# EAGLE schematic UmnitsaRGB (EAGLE 9.3.0)
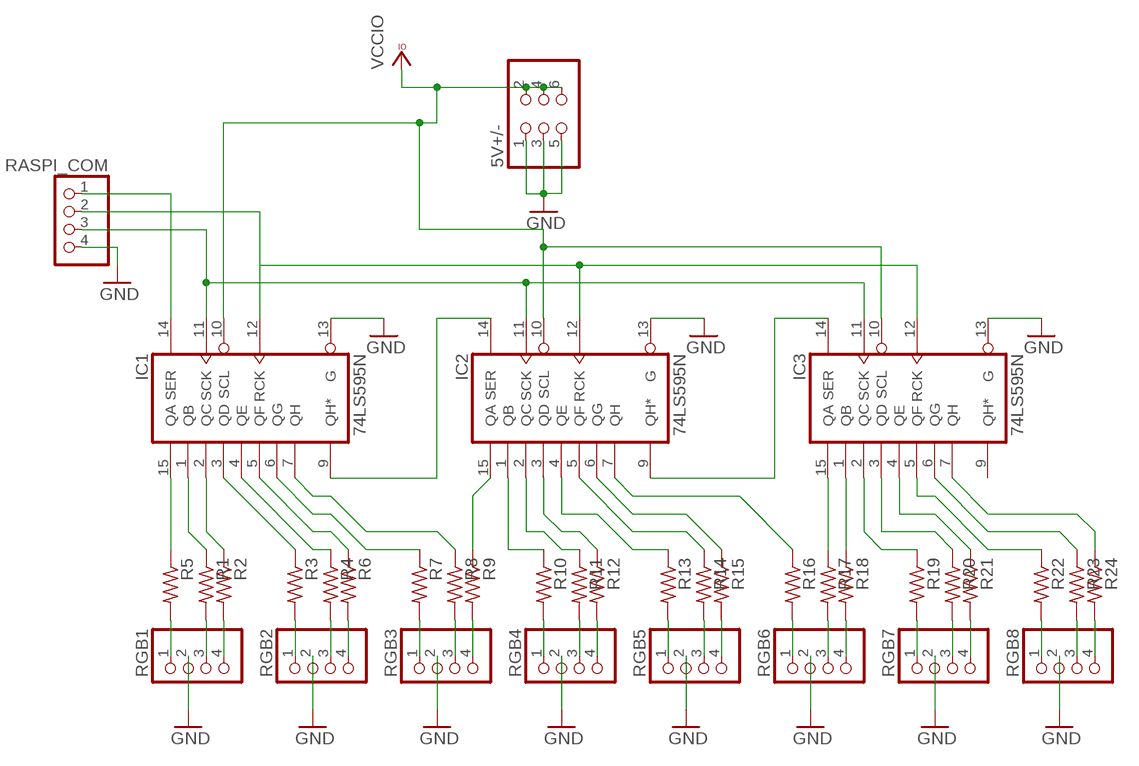
[diagram p0: schematic, sheet 1]

## Parts
5V+/-  PINHD-2X3  [2X03]
IC1  74LS595N  [DIL16]
IC2  74LS595N  [DIL16]
IC3  74LS595N  [DIL16]
R1  R-US_0204/7  [0204/7]
R2  R-US_0204/7  [0204/7]
R3  R-US_0204/7  [0204/7]
R4  R-US_0204/7  [0204/7]
R5  R-US_0204/7  [0204/7]
R6  R-US_0204/7  [0204/7]
R7  R-US_0204/7  [0204/7]
R8  R-US_0204/7  [0204/7]
R9  R-US_0204/7  [0204/7]
R10  R-US_0204/7  [0204/7]
R11  R-US_0204/7  [0204/7]
R12  R-US_0204/7  [0204/7]
R13  R-US_0204/7  [0204/7]
R14  R-US_0204/7  [0204/7]
R15  R-US_0204/7  [0204/7]
R16  R-US_0204/7  [0204/7]
R17  R-US_0204/7  [0204/7]
R18  R-US_0204/7  [0204/7]
R19  R-US_0204/7  [0204/7]
R20  R-US_0204/7  [0204/7]
R21  R-US_0204/7  [0204/7]
R22  R-US_0204/7  [0204/7]
R23  R-US_0204/7  [0204/7]
R24  R-US_0204/7  [0204/7]
RASPI_COM  PINHD-1X4  [1X04]
RGB1  PINHD-1X4  [1X04]
RGB2  PINHD-1X4  [1X04]
RGB3  PINHD-1X4  [1X04]
RGB4  PINHD-1X4  [1X04]
RGB5  PINHD-1X4  [1X04]
RGB6  PINHD-1X4  [1X04]
RGB7  PINHD-1X4  [1X04]
RGB8  PINHD-1X4  [1X04]

## Nets
GND [Power]: 5V+/-.1 5V+/-.3 5V+/-.5 IC1.13(G) IC2.13(G) IC3.13(G) RASPI_COM.4 RGB1.2 RGB2.2 RGB3.2 RGB4.2 RGB5.2 RGB6.2 RGB7.2 RGB8.2
N$1: R5.2 RGB1.1
N$2: R1.2 RGB1.3
N$3: R2.2 RGB1.4
N$4: R3.2 RGB2.1
N$5: R4.2 RGB2.3
N$6: R6.2 RGB2.4
N$7: R7.2 RGB3.1
N$8: R8.2 RGB3.3
N$9: R9.2 RGB3.4
N$10: R10.2 RGB4.1
N$11: R11.2 RGB4.3
N$12: R12.2 RGB4.4
N$13: R13.2 RGB5.1
N$14: R14.2 RGB5.3
N$15: R15.2 RGB5.4
N$16: R16.2 RGB6.1
N$17: R17.2 RGB6.3
N$18: R18.2 RGB6.4
N$19: IC1.14(SER) RASPI_COM.1
N$20: IC1.12(RCK) IC2.12(RCK) IC3.12(RCK) RASPI_COM.2
N$21: IC1.9(QH*) IC2.14(SER)
N$22: IC2.9(QH*) IC3.14(SER)
N$23: IC1.11(SCK) IC2.11(SCK) IC3.11(SCK) RASPI_COM.3
N$24: IC1.15(QA) R5.1
N$25: IC1.1(QB) R1.1
N$26: IC1.2(QC) R2.1
N$27: IC1.3(QD) R3.1
N$28: IC1.4(QE) R4.1
N$29: IC1.5(QF) R6.1
N$30: IC1.6(QG) R7.1
N$31: IC2.1(QB) R10.1
N$32: IC2.15(QA) R9.1
N$33: IC1.7(QH) R8.1
N$34: IC2.2(QC) R11.1
N$35: IC2.3(QD) R12.1
N$36: IC2.4(QE) R13.1
N$37: IC2.5(QF) R14.1
N$38: IC2.6(QG) R15.1
N$39: IC2.7(QH) R16.1
N$40: IC3.15(QA) R17.1
N$41: IC3.1(QB) R18.1
N$42: IC3.2(QC) R19.1
N$43: IC3.3(QD) R20.1
N$44: IC3.4(QE) R21.1
N$45: IC3.5(QF) R22.1
N$46: IC3.6(QG) R23.1
N$47: IC3.7(QH) R24.1
N$48: R19.2 RGB7.1
N$49: R20.2 RGB7.3
N$50: R21.2 RGB7.4
N$51: R22.2 RGB8.1
N$52: R23.2 RGB8.3
N$53: R24.2 RGB8.4
VCCIO [Power]: 5V+/-.2 5V+/-.4 5V+/-.6 IC1.10(SCL) IC2.10(SCL) IC3.10(SCL)
Unconnected: IC3.9(QH*)

## Power pins joined to a net without a drawn wire
GND: IC1.8(GND) IC2.8(GND) IC3.8(GND)
VCC: IC1.16(VCC) IC2.16(VCC) IC3.16(VCC)

## Library data of the parts
5V+/- = pinhead:PINHD-2X3: PIN HEADER
IC1-IC3 = 74xx-us:74*595: 8-bit SHIFT REGISTER, output latch
R1-R24 = resistor:R-US_: RESISTOR, American symbol
RASPI_COM RGB1-RGB8 = pinhead:PINHD-1X4: PIN HEADER

## Net classes
0 default: width 0.406 mm, clearance 0.457 mm
1 Power: width 1.016 mm, clearance 0.457 mm